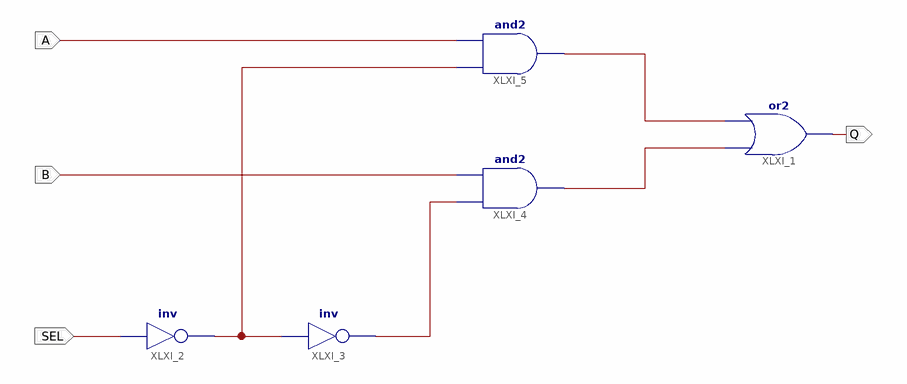
[diagram p0: schematic sheet 1]
// Xilinx ISE schematic data_selector2.sch (artix7) as structural Verilog: 5 symbols, 4 ports
module data_selector2 (
  input  A,
  input  B,
  input  SEL,
  output Q
);

  wire XLXN_1, XLXN_2, XLXN_4, XLXN_6;

  or XLXI_1 (Q, XLXN_2, XLXN_1);
  not XLXI_2 (XLXN_4, SEL);
  not XLXI_3 (XLXN_6, XLXN_4);
  and XLXI_4 (XLXN_2, XLXN_6, B);
  and XLXI_5 (XLXN_1, XLXN_4, A);
endmodule
